# Altium project Flyback.PrjPcb
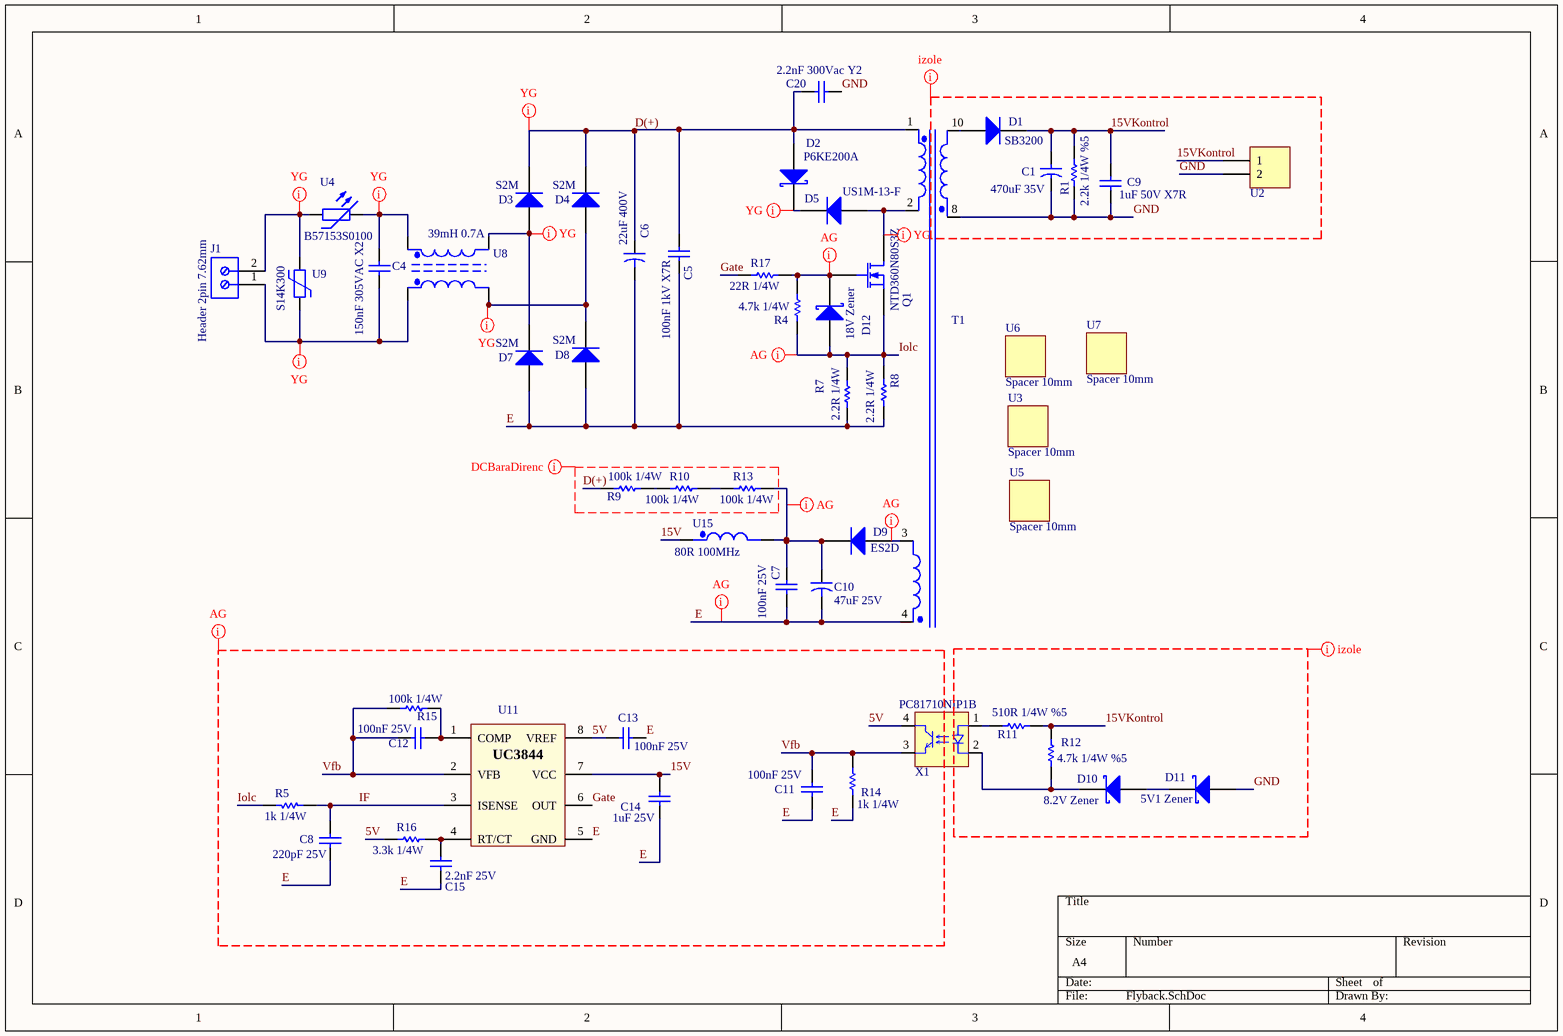
[diagram p0: Flyback.SchDoc]
1 sheet, 53 parts. Net scope: global (net labels, ports and power ports of the same name join across sheets).
Board file: Flyback.PcbDoc

## Sheet Flyback.SchDoc
size A4; PageSetup: Record=PageOptions|CenterHorizontal=True|CenterVertical=True|PrintScale=0.37|XCorrection=1.00|YCorrection=1.00|PrintKind=0|BorderSize=5000000|LeftOffset=0|BottomOffset=0|Orientation=2|PaperLength=1000|PaperWidth=1000|Scale=100|PaperSource=7|PrintQuality=-3|MediaType=1|DitherType=10|PrintScaleMode=1|PaperKind=A4|PaperIndex=9

### Parts
C1  470uF 35V  [CAPPRD500W60D1025H1750]
C4  150nF 305VAC X2  [CFR F15 L18 B6 H12]
C5  100nF 1kV X7R  [RCE7U2J333J5B1H03B]
C6  22uF 400V  [22uF 400V]
C7  100nF 25V  [1206]
C8  220pF 25V  [1206]
C9  1uF 50V X7R  [1206]
C10  47uF 25V  [CAPPRD200W50D525H1250]
C11  100nF 25V  [1206]
C12  100nF 25V  [1206]
C13  100nF 25V  [1206]
C14  1uF 25V  [1206]
C15  2.2nF 25V  [1206]
C20  2.2nF 300Vac Y2  [4x13x9]
D1  SB3200  [DO-201AD -Dik]
D2  P6KE200A  [DO-15((DO-204AC)]
D3  S2M  [DO-214AA(SMB)]
D4  S2M  [DO-214AA(SMB)]
D5  US1M-13-F  [DO-214AA(SMB)]
D7  S2M  [DO-214AA(SMB)]
D8  S2M  [DO-214AA(SMB)]
D9  ES2D  [DO-214AA(SMB)]
D10  8.2V Zener  [SOD-123]
D11  5V1 Zener  [SOD-123]
D12  18V Zener  [SOD-123]
J1  Header 2pin 7.62mm  [Header 2 Pin 7.62mm Vidalı]
Q1  NTD360N80S3Z  [DPAK IGBT]
R1  2.2k 1/4W %5  [R 1206]
R4  4.7k 1/4W  [R 1206]
R5  1k 1/4W  [R 1206]
R7  2.2R 1/4W  [R 1206]
R8  2.2R 1/4W  [R 1206]
R9  100k 1/4W  [R 1206]
R10  100k 1/4W  [R 1206]
R11  510R 1/4W %5  [R 1206]
R12  4.7k 1/4W %5  [R 1206]
R13  100k 1/4W  [R 1206]
R14  1k 1/4W  [R 1206]
R15  100k 1/4W  [R 1206]
R16  3.3k 1/4W  [R 1206]
R17  22R 1/4W  [R 1206]
T1  SMPS Tr  [SMPS Tr3]  (value not drawn)
U2  Terminal Blok 2 Pin 2.54mm  [Header 2pin 2.54mm Vidalı]  (value not drawn)
U3  Spacer 10mm  [Spacer 10mm Sogutucu]
U4  B57153S0100  [NTC B57153S0100]
U5  Spacer 10mm  [Spacer 10mm Sogutucu]
U6  Spacer 10mm  [Spacer 10mm Sogutucu]
U7  Spacer 10mm  [Spacer 10mm Sogutucu]
U8  39mH 0.7A  [EMC SMPS TDK]
U9  S14K300  [Varistor630V]
U11  UC3844  [SOIC-OA8_L]  (value not drawn)
U15  80R 100MHz  [1206 Bead]
X1  PC81710NIP1B  [PC817 SMD]

### Nets
5V: C13.2 R16.1 U11.8(VREF) X1.4(C)
15V: C14.2 U11.7(VCC) U15.1
15VKontrol: C1.1 C9.2 D1.2(K) R1.2 R11.1 R12.1 U2.1
D(+): C5.2 C6.1 C20.1 D2.1(A) D3.2(K) D4.2(K) R9.2 T1.1(Pri+)
E: C5.1 C6.2 C7.1 C8.1 C10.2 C11.1 C13.1 C14.1 C15.1 D7.1(A) D8.1(A) R7.1 R8.1 R14.1 T1.4(Sec3-) U11.5(GND)
Gate: R17.1 U11.6(OUT)
GND: C1.2 C9.1 C20.2 D11.1(A) R1.1 T1.8 U2.2
IF: C8.2 R5.1 U11.3(ISENSE)
Iolc: D12.1(A) Q1.3(S) R4.2 R5.2 R7.2 R8.2
Vfb: C11.2 C12.1 R14.2 R15.1 U11.2(VFB) X1.3(E)
NetC4_1: C4.1 J1.1 U8.1 U9.1
NetC4_2: C4.2 U4.2 U8.2
NetC7_2: C7.2 C10.1 D9.2(K) R13.1 U15.2
NetC12_2: C12.2 R15.2 U11.1(COMP)
NetC15_2: C15.2 R16.2 U11.4(RT/CT)
NetD1_1: D1.1(A) T1.10(Sec1+)
NetD2_2: D2.2(K) D5.2(K)
NetD3_1: D3.1(A) D7.2(K) U8.3
NetD4_1: D4.1(A) D8.2(K) U8.4
NetD5_1: D5.1(A) Q1.2(D) T1.2(Pri-)
NetD9_1: D9.1(A) T1.3(Sec3+)
NetD10_1: D10.1(A) D11.2(K)
NetD10_2: D10.2(K) R12.2 X1.2(K)
NetD12_2: D12.2(K) Q1.1(G) R4.1 R17.2
NetJ1_2: J1.2 U4.1 U9.2
NetR9_1: R9.1 R10.2
NetR10_1: R10.1 R13.2
NetR11_2: R11.2 X1.1(A)

### Layout directives
net class YG: D(+), NetC4_1, NetC4_2, NetD2_2, NetD3_1, NetD4_1, NetD5_1, NetJ1_2
net class AG: 5V, 15V, E, Gate, IF, Iolc, NetC7_2, NetD9_1, NetD12_2, Vfb
net class izole: 15VKontrol, GND
net class DCBaraDirenc: D(+)

### Library data of the parts
C1 = C 470uF 35V 1.76A 28mOhm: 860040475008; Published: 8-Jun-2000; LatestRevisionDate: 17-Jul-2002; LatestRevisionNote: Re-released for DXP Platform.; PackageReference: RAD-0.3; Publisher: Altium Limited; PackageDescription: Radial Cap, Thru-Hole; 2 Leads; 0.3 in Pin Spacing
C4 = Cap 150nF 305VAC X2: MPX154K305E; Part Number: 890273322005CS; Insulation Resistance: 30000MOhm; Dissipation Factor@100kHz: 0.26%; Dissipation Factor@1kHz: 0.1%; Pitch: 7.5mm; Rated Voltage: 250VDC; Rate of Voltage Rise: 340V/us; Technical Reference: MPPP075154J250DCPP45004; ComponentLink1Description: Manufacturer; ComponentLink1URL: http://www.we-online.de; ComponentLink2Description: Datasheet; ComponentLink2URL: https://katalog.we-online.com/pbs/datasheet/890273322005CS.pdf; Length: 10.5mm; Mounting Technology: THT; Packaging: Carton; Operating Temperature: -40 to +105degC; Width: 5mm; Capacitance: 150nF; Dissipation Factor@10kHz: 0.1%; Height: 11mm; Publisher: Wurth Elektronik; Published Date: August 2019
C5 = C Seramik 100nF 1kV X7R 5mm: RDER73A104K5B1H03B; Published: 8-Jun-2000; LatestRevisionDate: 17-Jul-2002; LatestRevisionNote: Re-released for DXP Platform.; PackageReference: RAD-0.3; Publisher: Altium Limited; PackageDescription: Radial Cap, Thru-Hole; 2 Leads; 0.3 in Pin Spacing
C6 = C 22uF 400V 537mArms: 860241378003; Manufacturer_Name: AVX; Manufacturer_Part_Number: TPSE107K020R0150; Allied_Number: 70002020; Datasheet Link: http://datasheets.avx.com/TPS.pdf; Height: 4.3mm; Mouser Part Number: 581-TPSE107K020R0150; Mouser Price/Stock: https://www.mouser.com/Search/Refine.aspx?Keyword=581-TPSE107K020R0150; RS Part Number: 1359911P; RS Price/Stock: http://uk.rs-online.com/web/p/products/1359911P; Allied Price/Stock: http://www.alliedelec.com/avx-tpse107k020r0150/70002020/
C7 C8 C11-C15 = C 1206: SMD 1206; Deger: *
C9 = C 1206: 490-3908-2-ND; Deger: *
C10 = C 47uF 25V 250mArms 400mOhm: 25YXJ47MTA5X11; ComponentLink1Description: http://www.rubycon.co.jp/en/catalog/e_pdfs/aluminum/e_px.pdf
C20 = Cap Y2 2.2nF MKP TDK: B32021A3222; Published: 8-Jun-2000; LatestRevisionDate: 17-Jul-2002; LatestRevisionNote: Re-released for DXP Platform.; PackageReference: RAD-0.3; Publisher: Altium Limited; PackageDescription: Radial Cap, Thru-Hole; 2 Leads; 0.3 in Pin Spacing
D1 = D MUR460: DO-201AD
D2 = TVS 200V DO-15: 497-13419-1-ND; Note: Pin 2 is not connected and not drawn.; Published: 21-Mar-2003; LatestRevisionDate: 29-May-2009; LatestRevisionNote: IPC-7351 Footprint Added.; DatasheetVersion: Oct-1999; PackageVersion: Sep-2001; PackageReference: SOT-23; Publisher: Altium Limited; PackageDescription: 3-Pin SOT-23 Package 0.95 mm Pitch, 2.5 mm Lead Span; ComponentLink1Description: Manufacturer Link; ComponentLink1URL: http://www.infineon.com/; ComponentLink2Description: Datasheet; ComponentLink2URL: http://www.infineon.com/upload/Document/cmc_upload/documents/009/363/bat17series.pdf
D3 D4 D7 D8 = 1N4007: DO-214AA(SMB)
D5 = ES2D: US1M-FDICT-ND
D9 = ES2D: ES2DFSCT-ND
D10 = Zener 1/4W: SOD-123; Note: Pin 2 is not connected and not drawn.; Published: 21-Mar-2003; LatestRevisionDate: 29-May-2009; LatestRevisionNote: IPC-7351 Footprint Added.; DatasheetVersion: Oct-1999; PackageVersion: Sep-2001; PackageReference: SOT-23; Publisher: Altium Limited; PackageDescription: 3-Pin SOT-23 Package 0.95 mm Pitch, 2.5 mm Lead Span; ComponentLink1Description: Manufacturer Link; ComponentLink1URL: http://www.infineon.com/; ComponentLink2Description: Datasheet; ComponentLink2URL: http://www.infineon.com/upload/Document/cmc_upload/documents/009/363/bat17series.pdf
D11 = Zener 1W: SOD-123; Note: Pin 2 is not connected and not drawn.; Published: 21-Mar-2003; LatestRevisionDate: 29-May-2009; LatestRevisionNote: IPC-7351 Footprint Added.; DatasheetVersion: Oct-1999; PackageVersion: Sep-2001; PackageReference: SOT-23; Publisher: Altium Limited; PackageDescription: 3-Pin SOT-23 Package 0.95 mm Pitch, 2.5 mm Lead Span; ComponentLink1Description: Manufacturer Link; ComponentLink1URL: http://www.infineon.com/; ComponentLink2Description: Datasheet; ComponentLink2URL: http://www.infineon.com/upload/Document/cmc_upload/documents/009/363/bat17series.pdf
D12 = Zener 0.5W: SOD-123; Note: Pin 2 is not connected and not drawn.; Published: 21-Mar-2003; LatestRevisionDate: 29-May-2009; LatestRevisionNote: IPC-7351 Footprint Added.; DatasheetVersion: Oct-1999; PackageVersion: Sep-2001; PackageReference: SOT-23; Publisher: Altium Limited; PackageDescription: 3-Pin SOT-23 Package 0.95 mm Pitch, 2.5 mm Lead Span; ComponentLink1Description: Manufacturer Link; ComponentLink1URL: http://www.infineon.com/; ComponentLink2Description: Datasheet; ComponentLink2URL: http://www.infineon.com/upload/Document/cmc_upload/documents/009/363/bat17series.pdf
J1 = Header 2pin 7.62mm Vidalı: 691214410002; Part Number: 691218410002; Compliance: Lead free / RoHS; Modularity: Yes; PCB/Cable/Panel: PCB; Pin Number: 2; Rated Current [UL]: 30A; Working Voltage [UL]: 300VAC; ComponentLink1Description: Manufacturer; ComponentLink1URL: http://www.we-online.de; ComponentLink2URL: https://katalog.we-online.de/em/datasheet/691218410002.pdf; ComponentLink2Description: Datasheet; Mounting Technology: THT; Packaging: Box; Operating Temperature: -40 to +105degC; Pitch: 7.62mm; Published Date: October 2019; Type: Horizontal; Publisher: Wurth Elektronik; Application: Rising Cage Clamp
Q1 = MOSFET DPAK: DPAK; Published: 8-Jun-2000; LatestRevisionDate: 17-Jul-2002; LatestRevisionNote: Re-released for DXP Platform.; PackageVersion: 1995/1996; PackageReference: E3; Publisher: Altium Limited; PackageDescription: TO, Flat Index; 3 In-Line, Axial Leads; Body Dia. 4.6mm; Lead Dia. 0.5 mm (max)
R1 = R 1206: 311-2.2KERTR-ND; Deger: *
R4 = 1/4W Karbon: SMD 1206
R5 = R 1206: SMD 1206/RC1206JR-07330RL/Digikey; Deger: *
R7 R8 R14-R17 = R 1206: SMD 1206; Deger: *
R9 R10 R13 = R 1206: SMD 126; Deger: *
R11 = R 1206: 311-100NLCT-ND; Deger: *
R12 = R 1206: 311-4.7KERCT-ND; Deger: *
T1 = SMPS Tr EF25: Sim Note: Enter the turns ratios, Core loss resistance, Magnetising Reactance, Leakage Reactances and Resistances referred to the primary side into the parameter fields.; Published: 25-Jan-2001; LatestRevisionDate: 17-Jul-2002; LatestRevisionNote: Re-released for DXP Platform.; PackageReference: TRF_8; Publisher: Altium Limited; PackageDescription: Transformer; 8 Leads
U2 = Header 2 Pin 2.54mm Vidalı: 691210910002; LatestRevisionDate: 17-Jul-2002; LatestRevisionNote: Re-released for DXP Platform.; Publisher: Altium Limited
U3 U5-U7 = Spacer 10mm: 10mm; LatestRevisionDate: 17-Jul-2002; LatestRevisionNote: Re-released for DXP Platform.; Publisher: Altium Limited
U4 = NTC B57153S0100: 495-2076-ND; Published: 8-Jun-2000; LatestRevisionDate: 17-Jul-2002; LatestRevisionNote: Re-released for DXP Platform.; PackageReference: AXIAL-0.4; Publisher: Altium Limited; PackageDescription: Axial Device, Thru-Hole; 2 Leads; 0.4 in Pin Spacing
U8 = EMC SMPS TDK 39mH 0.7A: B82732R2701B030
U9 = Varistor  S14K175: 495-1442-ND; Published: 8-Jun-2000; LatestRevisionDate: 17-Jul-2002; LatestRevisionNote: Re-released for DXP Platform.; PackageReference: AXIAL-0.4; Publisher: Altium Limited; PackageDescription: Axial Device, Thru-Hole; 2 Leads; 0.4 in Pin Spacing
U11 = UC3844: SOIC8; PackageReference: SOIC-OA8
U15 = Bead 1206: 732-1629-1-ND
X1 = PC817: 1855-1014-1-ND